# Altium project Quadrotor.PrjPcb (part 2 of 2)
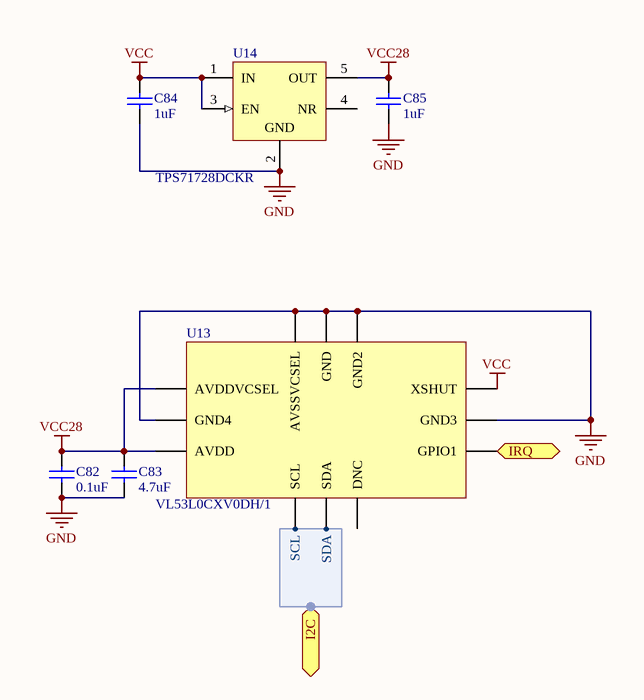
[diagram p12: DistanceSensorBottom.SchDoc]

## Nets that join several sheets
GND: 1 (7 pins), 2 (7 pins), 3 (7 pins), 4 (7 pins), A (C72_A.2 C73_A.1 R23_A.1 U10_A.4), D (C72_D.2 C73_D.1 R23_D.1 U10_D.4), B (C72_B.2 C73_B.1 R23_B.1 U10_B.4), C (C72_C.2 C73_C.1 R23_C.1 U10_C.4), Barometer (C6.1 U4.3 U4.4 U4.5), DistanceSensorFront (19 pins), MCU (17 pins), IMU (15 pins), Charging (21 pins), DW1000 (36 pins), Power (9 pins), IR (C81.1 R34.2 U12.4), DistanceSensorBottom (10 pins)
VBAT: 1 (C68_1.2 C69_1.1 C71_1.1 U11_1.10), 2 (C68_2.2 C69_2.1 C71_2.1 U11_2.10), 3 (C68_3.2 C69_3.1 C71_3.1 U11_3.10), 4 (C68_4.2 C69_4.1 C71_4.1 U11_4.10), A (C73_A.2 D6_A.4), D (C73_D.2 D6_D.4), B (C73_B.2 D6_B.4), C (C73_C.2 D6_C.4), Charging (C9.2 R12.2 U6.10), Power (6 pins), IR (C81.2 D8.A)
VCC: 1 (U11_1.15), 2 (U11_2.15), 3 (U11_3.15), 4 (U11_4.15), A (C72_A.1 U10_A.8), D (C72_D.1 U10_D.8), B (C72_B.1 U10_B.8), C (C72_C.1 U10_C.8), Barometer (C6.2 U4.1 U4.2), DistanceSensorFront (C17.1 C18.1 U7.14 U7.17), MCU (17 pins), IMU (7 pins), DW1000 (17 pins), Power (5 pins), IR (R33.1), DistanceSensorBottom (C84.2 U13.5 U14.1 U14.3)
VUSB: MCU (U1.46), Charging (C7.2 JP1.1 Q1.3 U5.9)
I2C.SCL: Barometer (U4.8), DistanceSensorFront (U7.6), Power (U2.4), DistanceSensorBottom (U13.10)
I2C.SDA: Barometer (U4.7), DistanceSensorFront (U7.5), Power (U2.5), DistanceSensorBottom (U13.9)
NetD2_C: MCU (U1.39), Charging (D2.C U6.8)
NetD3_C: MCU (U1.41), Charging (D3.C U5.7)
NetJP3_1: Quadrotor (JP3.1), 1 (U11_1.5 U11_1.16)
NetJP3_2: Quadrotor (JP3.2), 1 (U11_1.2 U11_1.3)
NetJP4_1: Quadrotor (JP4.1), 2 (U11_2.2 U11_2.3)
NetJP4_2: Quadrotor (JP4.2), 2 (U11_2.5 U11_2.16)
NetJP5_1: Quadrotor (JP5.1), 3 (U11_3.5 U11_3.16)
NetJP5_2: Quadrotor (JP5.2), 3 (U11_3.2 U11_3.3)
NetJP6_1: Quadrotor (JP6.1), 4 (U11_4.2 U11_4.3)
NetJP6_2: Quadrotor (JP6.2), 4 (U11_4.5 U11_4.16)
NetR6_1: MCU (U1.8), Power (R6.1 R9.2 SW1.4)
NetR6_2: MCU (U1.9), Power (R6.2 R7.2 U3.4)
NetR34_1: MCU (U1.23), IR (R34.1 U12.6)
NetU1_22: A (U10_A.6), MCU (U1.22)
NetU1_26: MCU (U1.26), DistanceSensorBottom (U13.7)
NetU1_27: DistanceSensorFront (U7.8), MCU (U1.27)
NetU1_28: DistanceSensorFront (U7.9), MCU (U1.28)
NetU1_54: MCU (U1.54), DW1000 (U8.45)
NetU10_A_5: A (U10_A.5), B (U10_B.6)
NetU10_B_5: B (U10_B.5), C (U10_C.6)
NetU10_C_5: D (U10_D.6), C (U10_C.5)